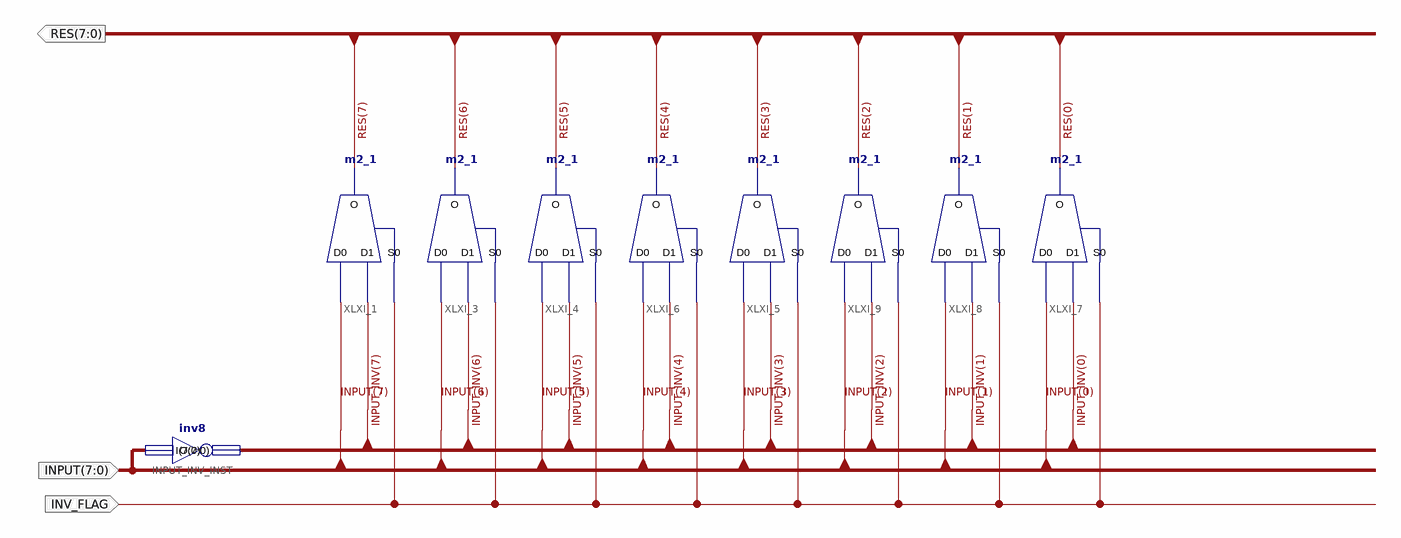
[diagram p0: schematic sheet 1]
// Xilinx ISE schematic invmux8bit.sch (spartan3e) as structural Verilog: 9 symbols, 3 ports
module invmux8bit (
  input  INV_FLAG,
  input  [7:0] INPUT,
  output [7:0] RES
);

  wire [7:0] INPUT_INV;

  m2_1 XLXI_1 (.D0(INPUT[7]), .D1(INPUT_INV[7]), .S0(INV_FLAG), .O(RES[7]));
  inv8 INPUT_INV_INST (.I(INPUT), .O(INPUT_INV));
  m2_1 XLXI_3 (.D0(INPUT[6]), .D1(INPUT_INV[6]), .S0(INV_FLAG), .O(RES[6]));
  m2_1 XLXI_4 (.D0(INPUT[5]), .D1(INPUT_INV[5]), .S0(INV_FLAG), .O(RES[5]));
  m2_1 XLXI_5 (.D0(INPUT[3]), .D1(INPUT_INV[3]), .S0(INV_FLAG), .O(RES[3]));
  m2_1 XLXI_6 (.D0(INPUT[4]), .D1(INPUT_INV[4]), .S0(INV_FLAG), .O(RES[4]));
  m2_1 XLXI_7 (.D0(INPUT[0]), .D1(INPUT_INV[0]), .S0(INV_FLAG), .O(RES[0]));
  m2_1 XLXI_8 (.D0(INPUT[1]), .D1(INPUT_INV[1]), .S0(INV_FLAG), .O(RES[1]));
  m2_1 XLXI_9 (.D0(INPUT[2]), .D1(INPUT_INV[2]), .S0(INV_FLAG), .O(RES[2]));
endmodule
